# EasyEDA schematic SCH_meta-RCU_2025-01-19.json

## Sheets
1 meta RCU: TITLE: meta RCU; REV: 1.0; Date: 2025-01-18; Sheet: 1/1; Company: Pantesting
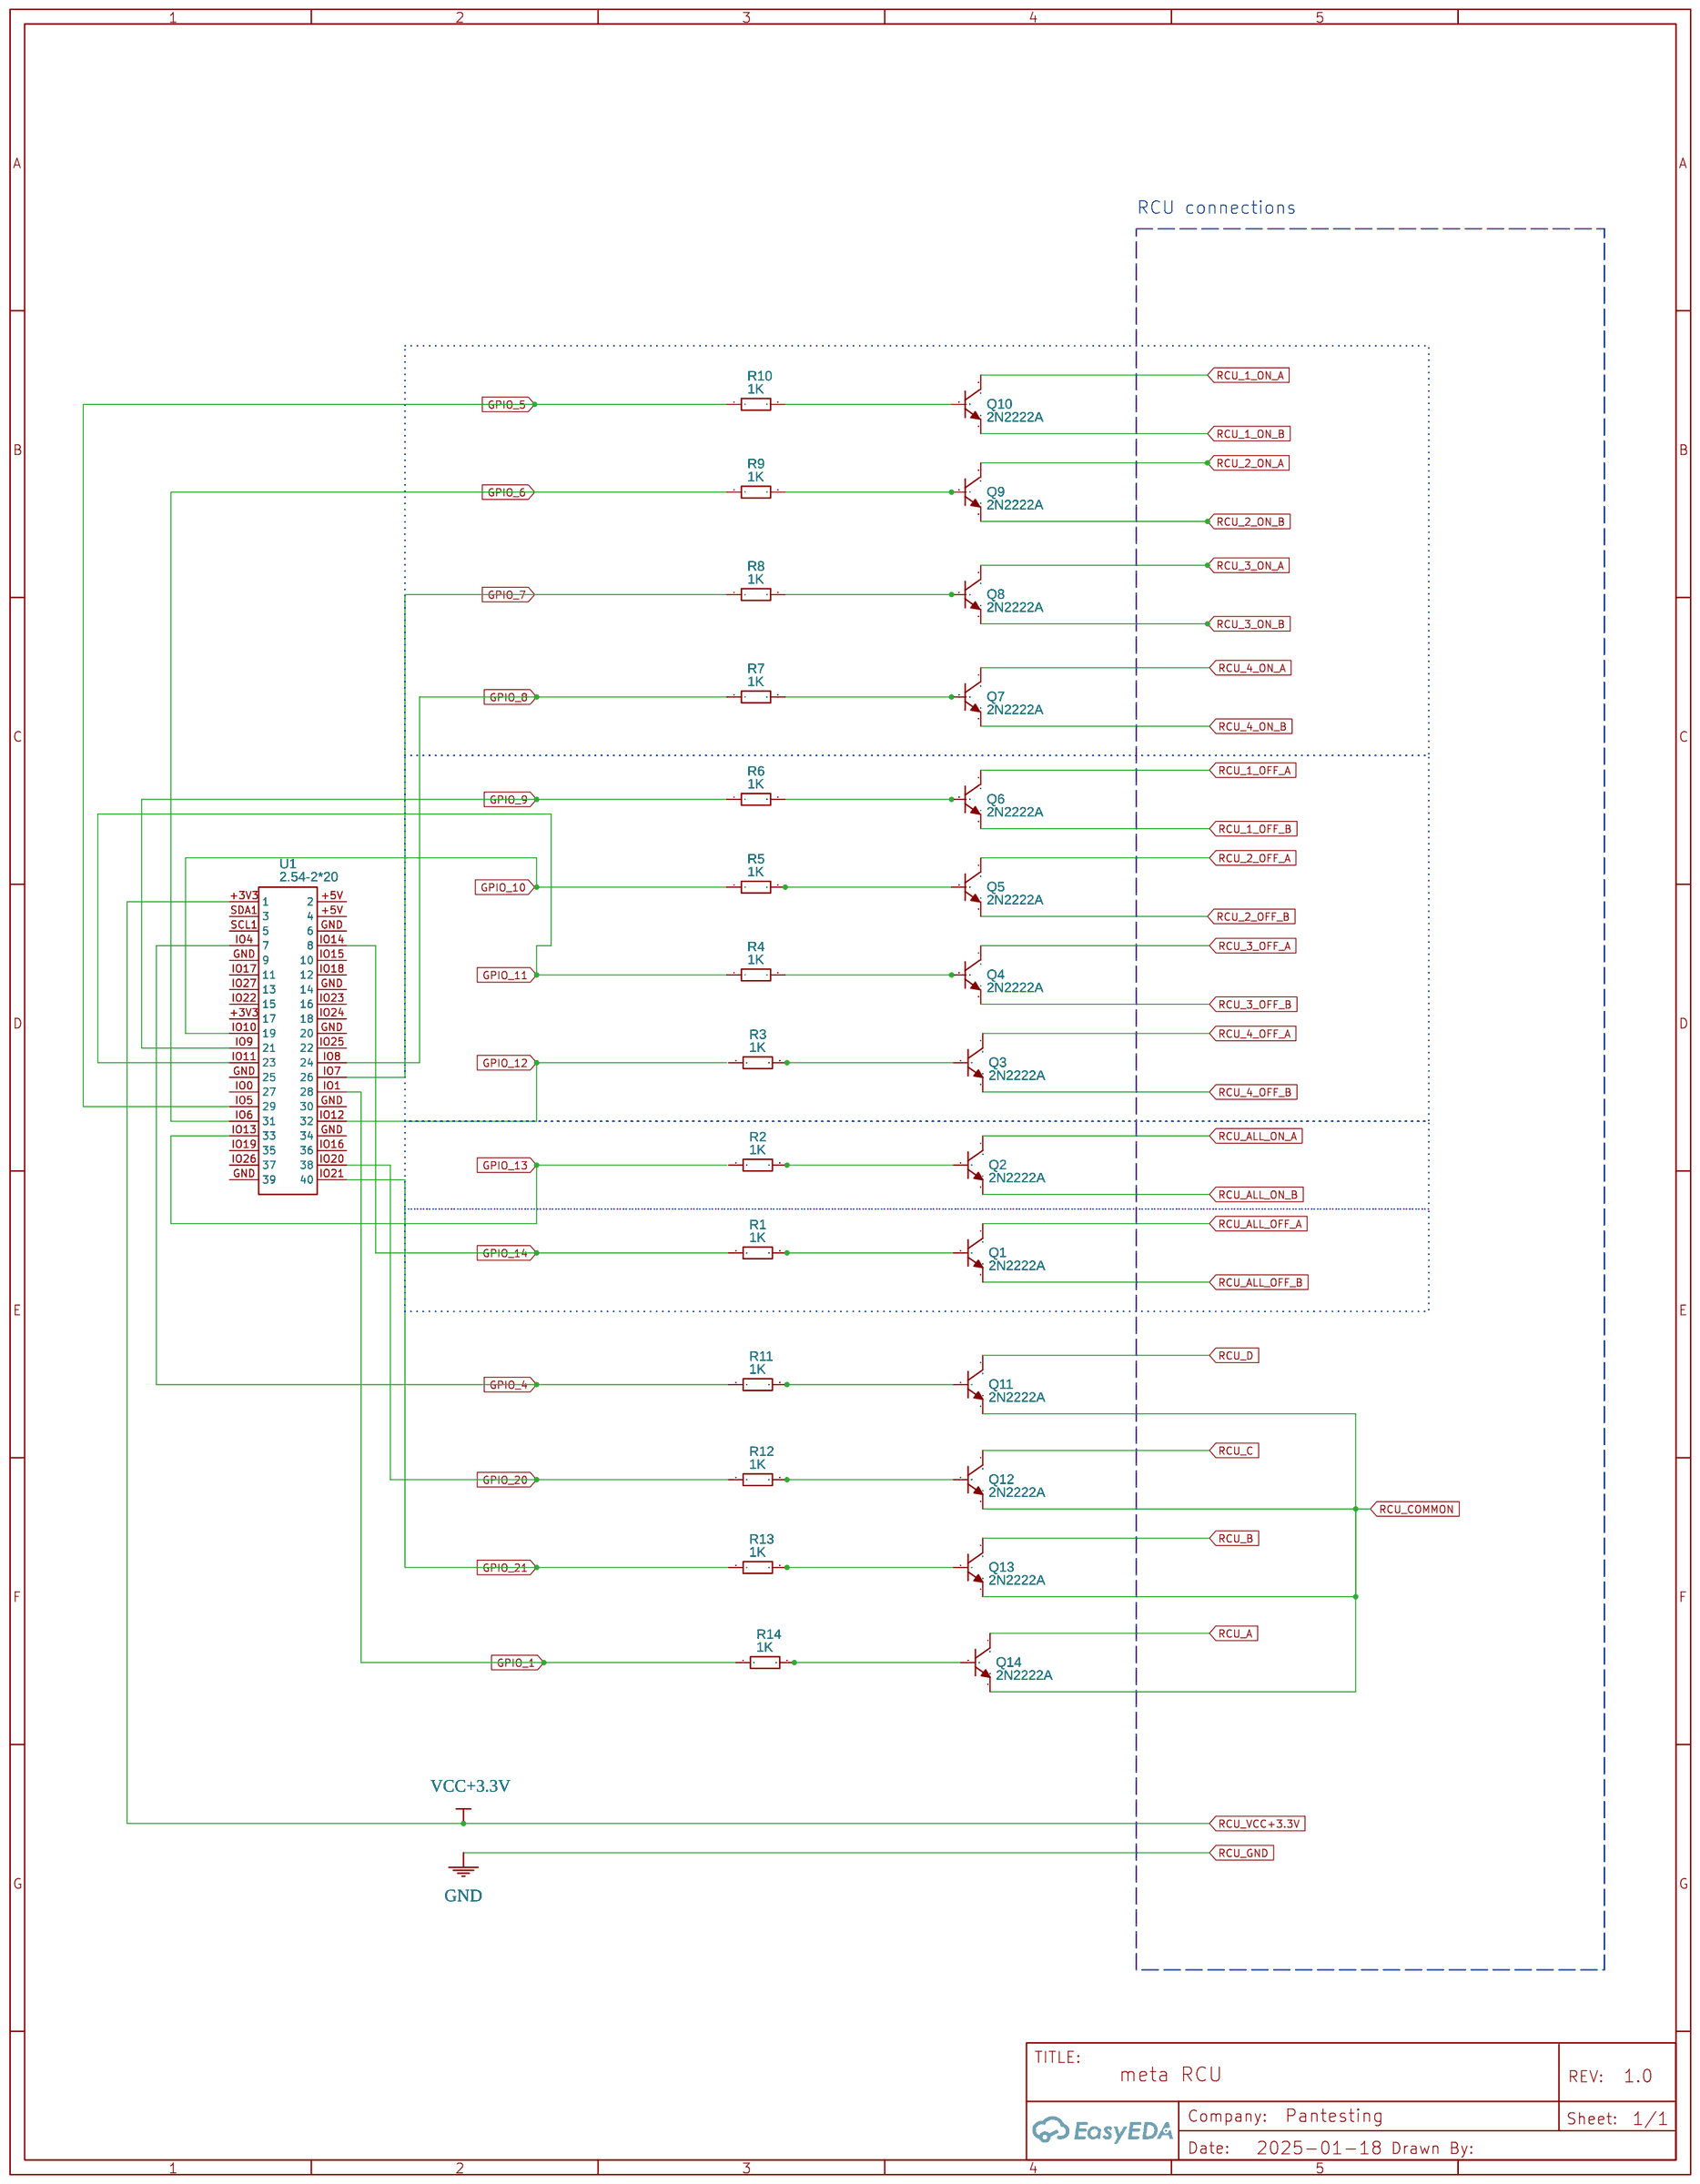
[diagram p0: meta RCU]
2 TAA02A RCU: TITLE: TAA02A RCU
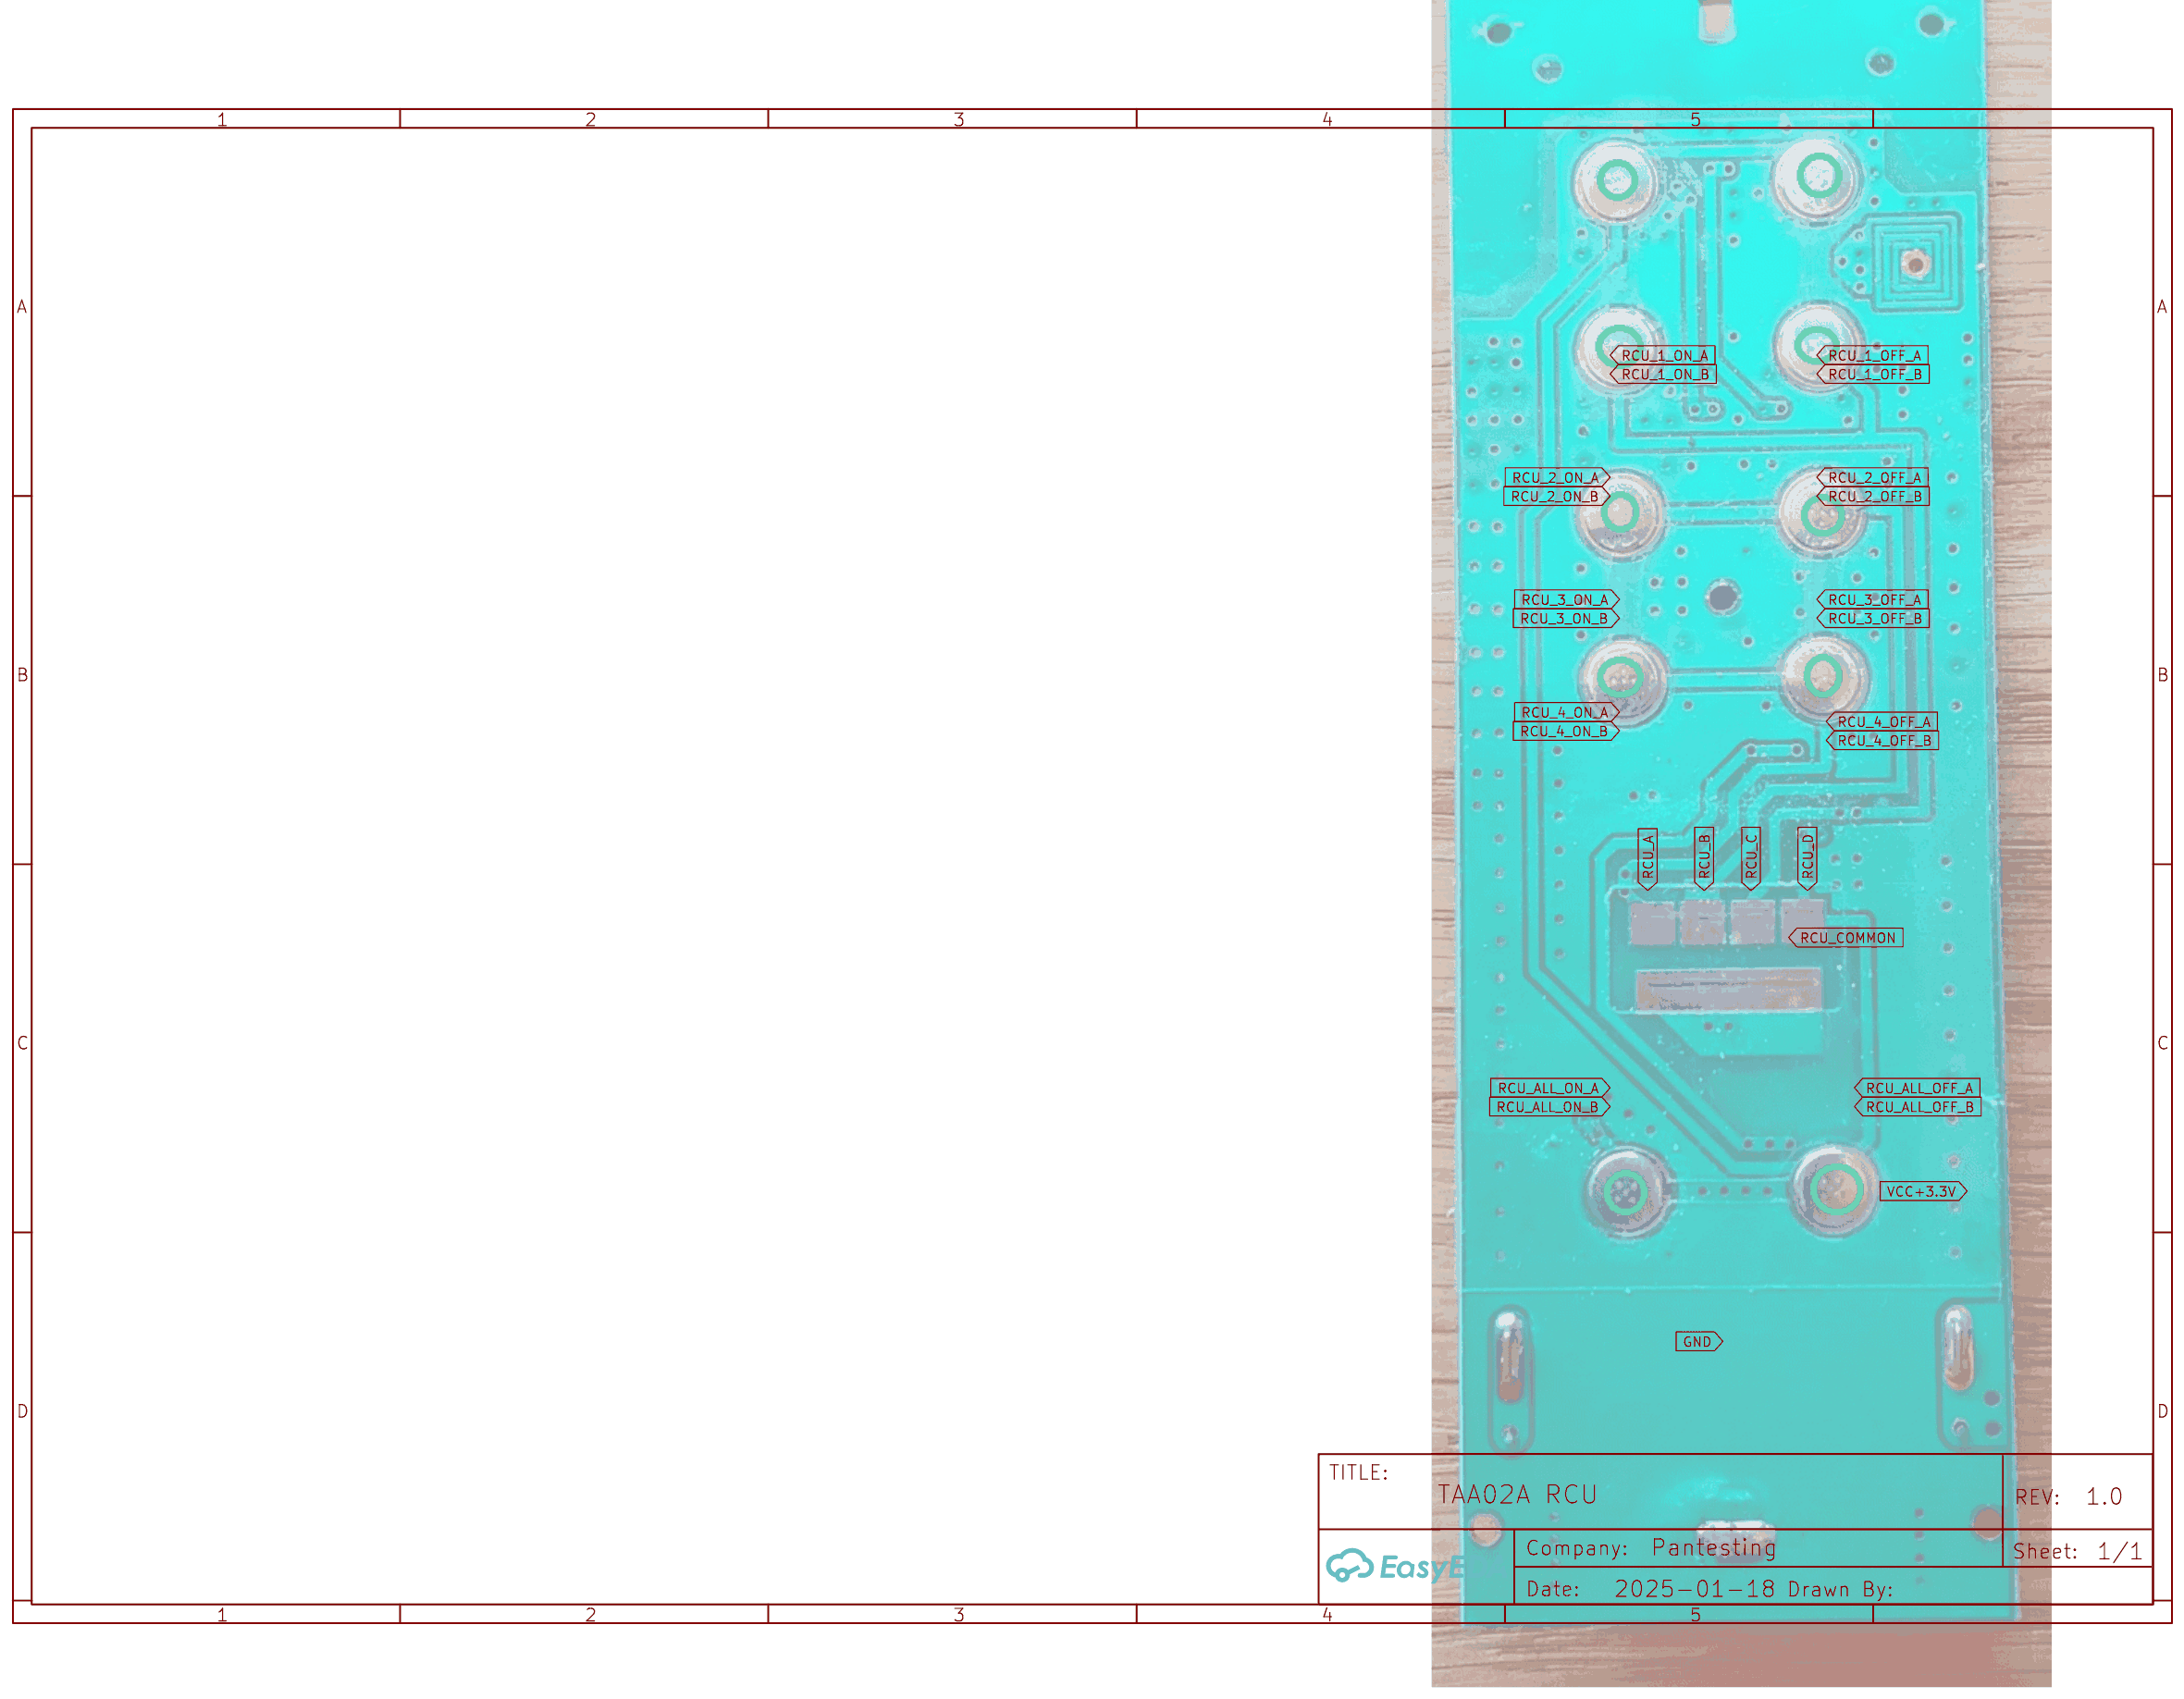
[diagram p1: TAA02A RCU]

## Parts
Q1  2N2222A  [TO-92-3_L4.8-W3.7-P2.54-R]
Q2  2N2222A  [TO-92-3_L4.8-W3.7-P2.54-R]
Q3  2N2222A  [TO-92-3_L4.8-W3.7-P2.54-R]
Q4  2N2222A  [TO-92-3_L4.8-W3.7-P2.54-R]
Q5  2N2222A  [TO-92-3_L4.8-W3.7-P2.54-R]
Q6  2N2222A  [TO-92-3_L4.8-W3.7-P2.54-R]
Q7  2N2222A  [TO-92-3_L4.8-W3.7-P2.54-R]
Q8  2N2222A  [TO-92-3_L4.8-W3.7-P2.54-R]
Q9  2N2222A  [TO-92-3_L4.8-W3.7-P2.54-R]
Q10  2N2222A  [TO-92-3_L4.8-W3.7-P2.54-R]
Q11  2N2222A  [TO-92-3_L4.8-W3.7-P2.54-R]
Q12  2N2222A  [TO-92-3_L4.8-W3.7-P2.54-R]
Q13  2N2222A  [TO-92-3_L4.8-W3.7-P2.54-R]
Q14  2N2222A  [TO-92-3_L4.8-W3.7-P2.54-R]
R1  1K  [RES-TH_BD2.2-L6.5-P10.50-D0.6]
R2  1K  [RES-TH_BD2.2-L6.5-P10.50-D0.6]
R3  1K  [RES-TH_BD2.2-L6.5-P10.50-D0.6]
R4  1K  [RES-TH_BD2.2-L6.5-P10.50-D0.6]
R5  1K  [RES-TH_BD2.2-L6.5-P10.50-D0.6]
R6  1K  [RES-TH_BD2.2-L6.5-P10.50-D0.6]
R7  1K  [RES-TH_BD2.2-L6.5-P10.50-D0.6]
R8  1K  [RES-TH_BD2.2-L6.5-P10.50-D0.6]
R9  1K  [RES-TH_BD2.2-L6.5-P10.50-D0.6]
R10  1K  [RES-TH_BD2.2-L6.5-P10.50-D0.6]
R11  1K  [RES-TH_BD2.2-L6.5-P10.50-D0.6]
R12  1K  [RES-TH_BD2.2-L6.5-P10.50-D0.6]
R13  1K  [RES-TH_BD2.2-L6.5-P10.50-D0.6]
R14  1K  [RES-TH_BD2.2-L6.5-P10.50-D0.6]
U1  2.54-2*20  [HDR-TH_40P-P2.54-V-F-R2-C20-S2.54]

## Library data of the parts
Q1-Q14 = 2N2222A: Contributor: LCSC; Supplier: LCSC; Supplier Part: C358533; Manufacturer: BLUE ROCKET(蓝箭); JLCPCB Part Class: Extended Part
R1-R14 = CFR0W4J0102A50: Supplier: LCSC; Manufacturer: UniOhm; Supplier Part: C61293; JLCPCB Part Class: Extended Part
U1 = 2.54-2*20: Contributor: LCSC; Supplier: LCSC; Supplier Part: C2977589; Manufacturer: ZHOURI(洲日); JLCPCB Part Class: Extended Part

## Nets
GPIO_1: U1.IO1(28)
GPIO_4: R11.1 U1.IO4(7)
GPIO_5: U1.IO5(29)
GPIO_6: U1.IO6(31)
GPIO_7: U1.IO7(26)
GPIO_8: R7.1 U1.IO8(24)
GPIO_9: R6.1 U1.IO9(21)
GPIO_10: R5.1 U1.IO10(19)
GPIO_11: R4.1 U1.IO11(23)
GPIO_12: U1.IO12(32)
GPIO_13: U1.IO13(33)
GPIO_14: U1.IO14(8)
GPIO_20: U1.IO20(38)
GPIO_21: U1.IO21(40)
RCU_1_ON_A: Q10.1(C)
RCU_1_ON_B: Q10.3(E)
RCU_2_OFF_B: Q5.3(E)
RCU_3_ON_B: Q8.3(E)
RCU_4_OFF_A: Q3.1(C)
RCU_4_OFF_B: Q3.3(E)
RCU_A: Q14.1(C)
RCU_ALL_OFF_A: Q1.1(C)
RCU_ALL_OFF_B: Q1.3(E)
RCU_ALL_ON_A: Q2.1(C)
RCU_ALL_ON_B: Q2.3(E)
RCU_B: Q13.1(C)
RCU_C: Q12.1(C)
RCU_COMMON: Q11.3(E) Q12.3(E) Q13.3(E) Q14.3(E)
RCU_D: Q11.1(C)
RCU_VCC+3.3V: U1.+3V3(1)
Net-(Q1-2): Q1.2(B) R1.2
Net-(Q2-2): Q2.2(B) R2.2
Net-(Q3-2): Q3.2(B) R3.2
Net-(Q4-2): Q4.2(B) R4.2
Net-(Q5-2): Q5.2(B) R5.2
Net-(Q6-2): Q6.2(B) R6.2
Net-(Q7-2): Q7.2(B) R7.2
Net-(Q8-2): Q8.2(B) R8.2
Net-(Q9-2): Q9.2(B) R9.2
Net-(Q10-2): Q10.2(B) R10.2
Net-(Q11-2): Q11.2(B) R11.2
Net-(Q12-2): Q12.2(B) R12.2
Net-(Q13-2): Q13.2(B) R13.2
Net-(Q14-2): Q14.2(B) R14.2

Not connected (* = marked no-connect by the designer): Q4 1(C) 3(E); Q5 1(C); Q6 1(C) 3(E); Q7 1(C) 3(E); Q8 1(C); Q9 1(C) 3(E); R1 1; R2 1; R3 1; R8 1; R9 1; R10 1; R12 1; R13 1; R14 1; U1 +5V(2) GND(6) IO0(27) IO15(10) IO16(36) IO17(11) IO18(12) IO19(35) IO22(15) IO23(16) IO24(18) IO25(22) IO26(37) IO27(13) SCL1(5) SDA1(3)

## Notes on the sheets
sheet 1
- RCU connections
